# Altium project st_linkv21_block1.PrjPCB
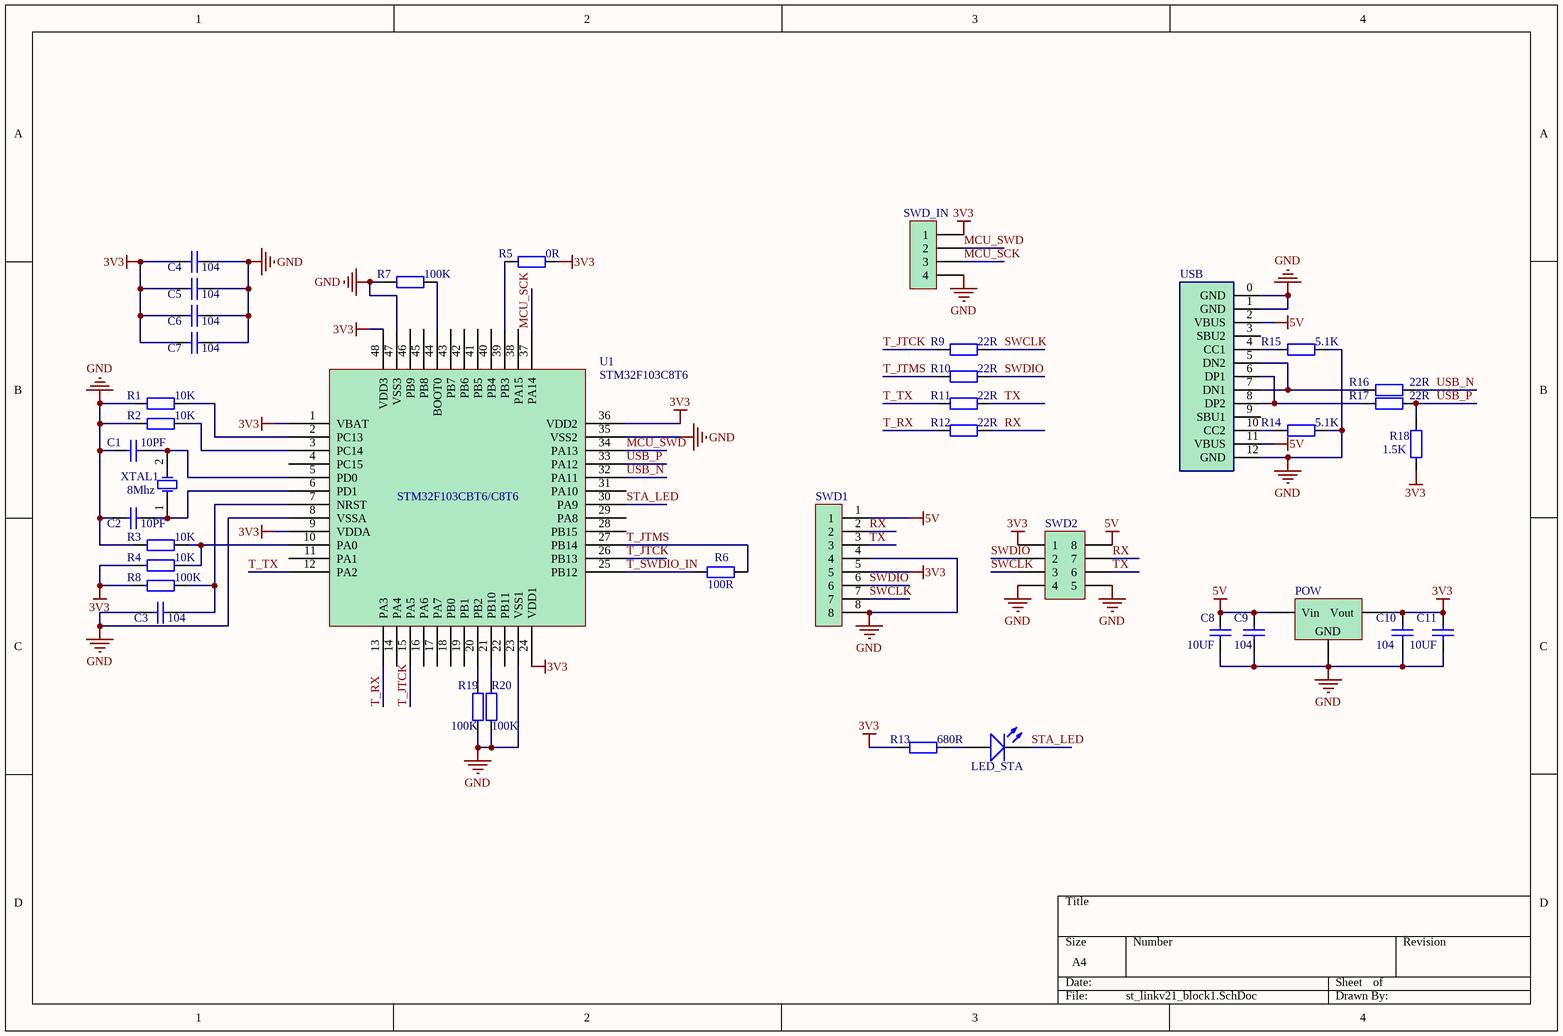
[diagram p0: st_linkv21_block1.SchDoc]
1 sheet, 39 parts. Net scope: global (net labels, ports and power ports of the same name join across sheets).
Board file: st_linkv21_block1.PcbDoc

## Sheet st_linkv21_block1.SchDoc
size A4

### Parts
C1  10PF  [0603_C]
C2  10PF  [0603_C]
C3  104  [0603_C]
C4  104  [0603_C]
C5  104  [0603_C]
C6  104  [0603_C]
C7  104  [0603_C]
C8  10UF  [0603_C]
C9  104  [0603_C]
C10  104  [0603_C]
C11  10UF  [0603_C]
LED_STA  0805_LED  [0805_LED]  (value not drawn)
POW  AMS1117_3.3  [SOT223]  (value not drawn)
R1  10K  [0603_R]
R2  10K  [0603_R]
R3  10K  [0603_R]
R4  10K  [0603_R]
R5  0R  [0603_R]
R6  100R  [0603_R]
R7  100K  [0603_R]
R8  100K  [0603_R]
R9  22R  [0603_R]
R10  22R  [0603_R]
R11  22R  [0603_R]
R12  22R  [0603_R]
R13  680R  [0603_R]
R14  5.1K  [0603_R]
R15  5.1K  [0603_R]
R16  22R  [0603_R]
R17  22R  [0603_R]
R18  1.5K  [0603_R]
R19  100K  [0603_R]
R20  100K  [0603_R]
SWD1  Header_1.27_8P  [HDR1.27_8P]  (value not drawn)
SWD2  Header_2.54_4p_2  [HDR2_4P]  (value not drawn)
SWD_IN  Header_2.54  [HDR1_4P]  (value not drawn)
U1  STM32F103C8T6  [LQFP48]
USB  USB_C_16P_SMT  [USB_C_16PIN_SMT]  (value not drawn)
XTAL1  8Mhz  [XTAL_5032_2]

### Nets
3V3: C4.1 C5.1 C6.1 C7.1 C10.2 C11.2 POW.2(Vout) R4.1 R5.2 R8.1 R13.1 R18.1 SWD1.5 SWD2.1 SWD_IN.1 U1.1(VBAT) U1.9(VDDA) U1.24(VDD1) U1.36(VDD2) U1.48(VDD3)
5V: C8.2 C9.2 POW.3(Vin) SWD1.1 SWD2.8 USB.2(VBUS) USB.11(VBUS)
GND: C1.1 C2.1 C3.1 C4.2 C5.2 C6.2 C7.2 C8.1 C9.1 C10.1 C11.1 POW.1(GND) R1.1 R2.1 R3.1 R7.1 R14.2 R15.2 R19.1 R20.1 SWD1.4 SWD1.8 SWD2.4 SWD2.5 SWD_IN.4 U1.8(VSSA) U1.23(VSS1) U1.35(VSS2) U1.47(VSS3) USB.0(GND) USB.1(GND) USB.12(GND)
MCU_SCK: SWD_IN.3 U1.37(PA14)
MCU_SWD: SWD_IN.2 U1.34(PA13)
RX: R12.2 SWD1.2 SWD2.7
STA_LED: LED_STA.K U1.30(PA9)
SWCLK: R9.2 SWD1.7 SWD2.3
SWDIO: R10.2 SWD1.6 SWD2.2
T_JTCK: R9.1 U1.15(PA5) U1.26(PB13)
T_JTMS: R6.2 R10.1 U1.27(PB14)
T_RX: R12.1 U1.13(PA3)
T_SWDIO_IN: R6.1 U1.25(PB12)
T_TX: R11.1 U1.12(PA2)
TX: R11.2 SWD1.3 SWD2.6
USB_N: R16.2 U1.32(PA11)
USB_P: R17.2 R18.2 U1.33(PA12)
NetC1_2: C1.2 U1.5(PD0) XTAL1.2(OSC2)
NetC2_2: C2.2 U1.6(PD1) XTAL1.1(OSC1)
NetC3_2: C3.2 R8.2 U1.7(NRST)
NetLED_STA_A: LED_STA.A R13.2
NetR1_2: R1.2 U1.2(PC13)
NetR2_2: R2.2 U1.3(PC14)
NetR3_2: R3.2 R4.2 U1.10(PA0)
NetR5_1: R5.1 U1.39(PB3)
NetR7_2: R7.2 U1.44(BOOT0)
NetR14_1: R14.1 USB.10(CC2)
NetR15_1: R15.1 USB.4(CC1)
NetR16_1: R16.1 USB.5(DN2) USB.7(DN1)
NetR17_1: R17.1 USB.6(DP1) USB.8(DP2)
NetR19_2: R19.2 U1.20(PB2)
NetR20_2: R20.2 U1.21(PB10)

Not connected (* = marked no-connect by the designer): U1 4(PC15) 11(PA1) 14(PA4) 16(PA6) 17(PA7) 18(PB0) 19(PB1) 22(PB11) 28(PB15) 29(PA8) 31(PA10) 38(PA15) 40(PB4) 41(PB5) 42(PB6) 43(PB7) 45(PB8) 46(PB9); USB 3(SBU2) 9(SBU1)

### Notes on the sheet
- (in symbol STM32F103C8T6) STM32F103CBT6/C8T6

### Library data of the parts
C1-C11 = 0603_CAP
R1-R20 = 0603_RES
SWD_IN = Header_2.54_4P
XTAL1 = XTAL_8MHz_5032_2